# EAGLE design diptera (EAGLE 5.10)
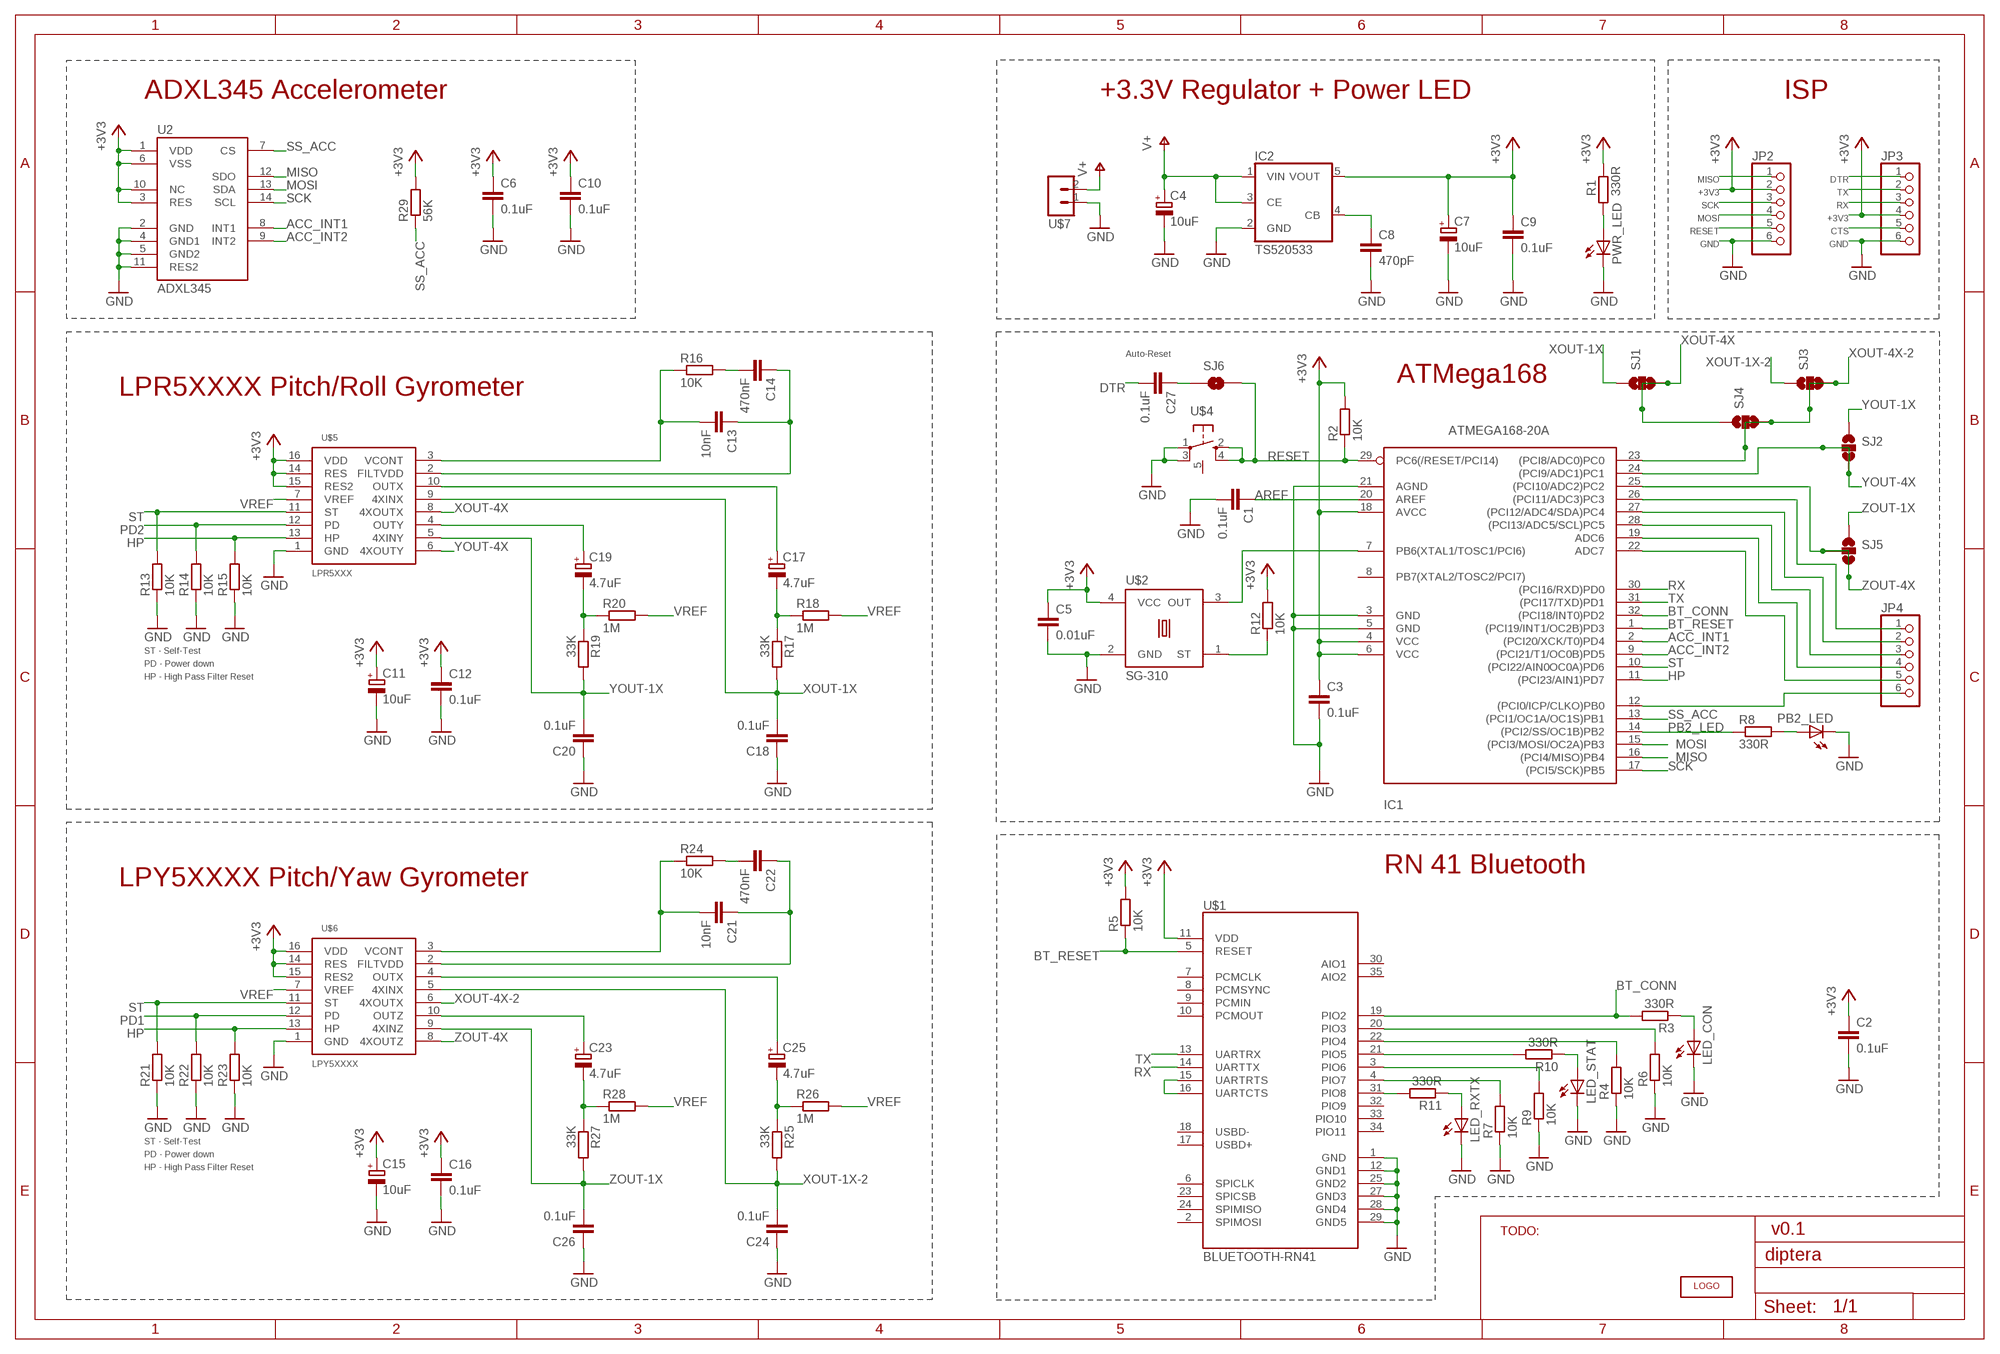
[diagram p0: schematic, sheet 1]

## Parts
C1  0.1uF  C-EUC0603K  [C0603K]
C2  0.1uF  C-EUC0603  [C0603]
C3  0.1uF  C-EUC0603K  [C0603K]
C4  10uF  CPOL-EUSMCA  [SMC_A]
C5  0.01uF  C-EUC0603K  [C0603K]
C6  0.1uF  C-EUC0603  [C0603]
C7  10uF  CPOL-EUSMCA  [SMC_A]
C8  470pF  C-EUC0603K  [C0603K]
C9  0.1uF  C-EUC0603K  [C0603K]
C10  0.1uF  C-EUC0603  [C0603]
C11  10uF  CPOL-EUSMCA  [SMC_A]
C12  0.1uF  C-EUC0603K  [C0603K]
C13  10nF  C-EUC0603K  [C0603K]
C14  470nF  C-EUC0603K  [C0603K]
C15  10uF  CPOL-EUSMCA  [SMC_A]
C16  0.1uF  C-EUC0603K  [C0603K]
C17  4.7uF  CPOL-EUSMCA  [SMC_A]
C18  0.1uF  C-EUC0603K  [C0603K]
C19  4.7uF  CPOL-EUSMCA  [SMC_A]
C20  0.1uF  C-EUC0603K  [C0603K]
C21  10nF  C-EUC0603K  [C0603K]
C22  470nF  C-EUC0603K  [C0603K]
C23  4.7uF  CPOL-EUSMCA  [SMC_A]
C24  0.1uF  C-EUC0603K  [C0603K]
C25  4.7uF  CPOL-EUSMCA  [SMC_A]
C26  0.1uF  C-EUC0603K  [C0603K]
C27  0.1uF  C-EUC0603K  [C0603K]
IC1  ATMEGA168-20A  [TQFP32-08]
IC2  TS520533  [SOT25]
JP2  PINHD-1X6  [1X06]
JP3  PINHD-1X6  [1X06]
JP4  PINHD-1X6  [1X06]
LED_CON  LEDCHIPLED_0805  [CHIPLED_0805]
LED_RXTX  LEDCHIPLED_0805  [CHIPLED_0805]
LED_STAT  LEDCHIPLED_0805  [CHIPLED_0805]
PB2_LED  LEDCHIPLED_0805  [CHIPLED_0805]
PWR_LED  LEDCHIPLED_0805  [CHIPLED_0805]
R1  330R  R-EU_R0603  [R0603]
R2  10K  R-EU_R0603  [R0603]
R3  330R  R-EU_R0603  [R0603]
R4  10K  R-EU_R0603  [R0603]
R5  10K  R-EU_R0603  [R0603]
R6  10K  R-EU_R0603  [R0603]
R7  10K  R-EU_R0603  [R0603]
R8  330R  R-EU_R0603  [R0603]
R9  10K  R-EU_R0603  [R0603]
R10  330R  R-EU_R0603  [R0603]
R11  330R  R-EU_R0603  [R0603]
R12  10K  R-EU_R0603  [R0603]
R13  10K  R-EU_R0603  [R0603]
R14  10K  R-EU_R0603  [R0603]
R15  10K  R-EU_R0603  [R0603]
R16  10K  R-EU_R0603  [R0603]
R17  33K  R-EU_R0603  [R0603]
R18  1M  R-EU_R0603  [R0603]
R19  33K  R-EU_R0603  [R0603]
R20  1M  R-EU_R0603  [R0603]
R21  10K  R-EU_R0603  [R0603]
R22  10K  R-EU_R0603  [R0603]
R23  10K  R-EU_R0603  [R0603]
R24  10K  R-EU_R0603  [R0603]
R25  33K  R-EU_R0603  [R0603]
R26  1M  R-EU_R0603  [R0603]
R27  33K  R-EU_R0603  [R0603]
R28  1M  R-EU_R0603  [R0603]
R29  56K  R-EU_R0603  [R0603]
SJ1  SOLDERJUMPER_2WAYPASTE2&3  [SJ_3_PASTE2&3]
SJ2  SOLDERJUMPER_2WAYPASTE2&3  [SJ_3_PASTE2&3]
SJ3  SOLDERJUMPER_2WAYPASTE2&3  [SJ_3_PASTE2&3]
SJ4  SOLDERJUMPER_2WAYPASTE2&3  [SJ_3_PASTE2&3]
SJ5  SOLDERJUMPER_2WAYPASTE2&3  [SJ_3_PASTE2&3]
SJ6  SOLDERJUMPERNC  [SJ_2S]
U2  ADXL345  [LGA14]
U$1  BLUETOOTH-RN41  [RN41]
U$2  SG-310  [SG-310]
U$3  LOGOSMALL  [LOGO-SMALL]
U$4  MCIPTG23K-V  [MCIPTG]
U$5  LPR5XXX  [LPR5XXX]
U$6  LPY5XXXX  [LPY5XXX]
U$7  2X1_JST_HEADER_SIDE-ENTRY  [2X1_JSP_HEADER_SIDE-ENTRY]

## Nets
+3V3: C2.1 C3.1 C5.1 C6.1 C7.+ C9.1 C10.1 C11.+ C12.1 C15.+ C16.1 IC1.4(VCC) IC1.6(VCC) IC1.18(AVCC) IC2.5(VOUT) JP2.2 JP3.4 R1.2 R2.2 R5.2 R12.2 R29.2 U2.1(VDD) U2.3(RES) U2.6(VSS) U2.10(NC) U$1.11(VDD) U$2.4(VCC) U$5.14(RES) U$5.15(RES2) U$5.16(VDD) U$6.14(RES) U$6.15(RES2) U$6.16(VDD)
ACC_INT1: IC1.2((PCI20/XCK/T0)PD4) U2.8(INT1)
ACC_INT2: IC1.9((PCI21/T1/OC0B)PD5) U2.9(INT2)
AREF: C1.1 IC1.20(AREF)
BT_CONN: IC1.32((PCI18/INT0)PD2) R3.2 U$1.19(PIO2)
BT_RESET: IC1.1((PCI19/INT1/OC2B)PD3) R5.1 U$1.5(RESET)
BT_STATUS: R10.2 U$1.21(PIO5)
CTS: JP3.5
DTR: C27.2 JP3.1
GND: C1.2 C2.2 C3.2 C4.- C5.2 C6.2 C7.- C8.2 C9.2 C10.2 C11.- C12.2 C15.- C16.2 C18.1 C20.1 C24.1 C26.1 IC1.3(GND) IC1.5(GND) IC1.21(AGND) IC2.2(GND) JP2.6 JP3.6 LED_CON.C LED_RXTX.C LED_STAT.C PB2_LED.C PWR_LED.C R4.1 R6.1 R7.1 R9.1 R13.1 R14.1 R15.1 R21.1 R22.1 R23.1 U2.2(GND) U2.4(GND1) U2.5(GND2) U2.11(RES2) U$1.1(GND) U$1.12(GND1) U$1.25(GND2) U$1.27(GND3) U$1.28(GND4) U$1.29(GND5) U$2.2(GND) U$4.1 U$4.3 U$5.1(GND) U$6.1(GND) U$7.1
HP: IC1.11((PCI23/AIN1)PD7) R15.2 R23.2 U$5.13(HP) U$6.13(HP)
MISO: IC1.16((PCI4/MISO)PB4) JP2.1 U2.12(SDO)
MOSI: IC1.15((PCI3/MOSI/OC2A)PB3) JP2.4 U2.13(SDA)
N$2: IC1.7(PB6(XTAL1/TOSC1/PCI6)) U$2.3(OUT)
N$3: PWR_LED.A R1.1
N$4: U$1.15(UARTRTS) U$1.16(UARTCTS)
N$5: LED_CON.A R3.1
N$6: R7.2 U$1.4(PIO7)
N$7: R4.2 U$1.22(PIO4)
N$8: R6.2 U$1.20(PIO3)
N$9: R9.2 U$1.3(PIO6)
N$10: LED_RXTX.A R11.1
N$11: LED_STAT.A R10.1
N$12: R11.2 U$1.31(PIO8)
N$13: C8.1 IC2.4(CB)
N$14: R12.1 U$2.1(ST)
N$15: C13.2 R16.1 U$5.3(VCONT)
N$16: C14.2 R16.2
N$17: C17.+ U$5.10(OUTX)
N$18: C17.- R17.1 R18.1
N$19: C19.+ U$5.4(OUTY)
N$20: C19.- R19.1 R20.1
N$21: C13.1 C14.1 U$5.2(FILTVDD)
N$23: IC1.26((PCI11/ADC3)PC3) JP4.1
N$24: C21.2 R24.1 U$6.3(VCONT)
N$25: C22.2 R24.2
N$26: C25.+ U$6.4(OUTX)
N$27: C25.- R25.1 R26.1
N$28: C23.+ U$6.10(OUTZ)
N$29: C23.- R27.1 R28.1
N$30: C21.1 C22.1 U$6.2(FILTVDD)
N$34: PB2_LED.A R8.2
N$35: IC1.27((PCI12/ADC4/SDA)PC4) JP4.2
N$36: IC1.28((PCI13/ADC5/SCL)PC5) JP4.3
N$37: IC1.19(ADC6) JP4.4
N$38: IC1.22(ADC7) JP4.5
N$39: IC1.12((PCI0/ICP/CLKO)PB0) JP4.6
N$40: C27.1 SJ6.1
PB2_LED: IC1.14((PCI2/SS/OC1B)PB2) R8.1
PD1: R22.2 U$6.12(PD)
PD2: R14.2 U$5.12(PD)
RESET: IC1.29(PC6(/RESET/PCI14)) JP2.5 R2.1 SJ6.2 U$4.2 U$4.4
RX: IC1.30((PCI16/RXD)PD0) JP3.3 U$1.14(UARTTX)
SCK: IC1.17((PCI5/SCK)PB5) JP2.3 U2.14(SCL)
SS_ACC: IC1.13((PCI1/OC1A/OC1S)PB1) R29.1 U2.7(CS)
ST: IC1.10((PCI22/AIN0OC0A)PD6) R13.2 R21.2 U$5.11(ST) U$6.11(ST)
TX: IC1.31((PCI17/TXD)PD1) JP3.2 U$1.13(UARTRX)
V+: C4.+ IC2.1(VIN) IC2.3(CE) U$7.2
VREF: R18.2 R20.2 R26.2 R28.2 U$5.7(VREF) U$6.7(VREF)
XOUT-1X: C18.2 R17.2 SJ1.1 U$5.9(4XINX)
XOUT-1X-2: C24.2 R25.2 SJ3.1 U$6.5(4XINX)
XOUT-4X: SJ1.2 SJ1.3 SJ4.1 U$5.8(4XOUTX)
XOUT-4X-2: IC1.23((PCI8/ADC0)PC0) SJ3.2 SJ3.3 SJ4.2 SJ4.3 U$6.6(4XOUTX)
YOUT-1X: C20.2 R19.2 SJ2.1 U$5.5(4XINY)
YOUT-4X: IC1.24((PCI9/ADC1)PC1) SJ2.2 SJ2.3 U$5.6(4XOUTY)
ZOUT-1X: C26.2 R27.2 SJ5.1 U$6.9(4XINZ)
ZOUT-4X: IC1.25((PCI10/ADC2)PC2) SJ5.2 SJ5.3 U$6.8(4XOUTZ)
Unconnected: IC1.8(PB7(XTAL2/TOSC2/PCI7)) U$1.2(SPIMOSI) U$1.6(SPICLK) U$1.7(PCMCLK) U$1.8(PCMSYNC) U$1.9(PCMIN) U$1.10(PCMOUT) U$1.17(USBD+) U$1.18(USBD-) U$1.23(SPICSB) U$1.24(SPIMISO) U$1.30(AIO1) U$1.32(PIO9) U$1.33(PIO10) U$1.34(PIO11) U$1.35(AIO2) U$4.5

## Notes on the sheet
- ADXL345 Accelerometer | +3.3V Regulator + Power LED | ISP
- Auto-Reset
- ATMega168
- LPR5XXXX Pitch/Roll Gyrometer
- ST - Self-Test
- PD - Power down
- HP - High Pass Filter Reset
- RN 41 Bluetooth
- LPY5XXXX Pitch/Yaw Gyrometer
- ST - Self-Test
- PD - Power down
- HP - High Pass Filter Reset
- TODO: | v0.1

## Library data of the parts
C1-C3 C5 C6 C8-C10 C12-C14 C16 C18 C20-C22 C24 C26 C27 = rcl:C-EU: CAPACITOR, European symbol
C4 C7 C11 C15 C17 C19 C23 C25 = rcl:CPOL-EU: POLARIZED CAPACITOR, European symbol
IC1 = avr:ATMEGA168: MICROCONTROLLER 16 kBytes FLASH 1 kBytes SRAM 512 Bytes EEPROM USART 8-channel 10 bit ADC
IC2 = v-reg:TS5205: 150mA Low Noise LDO Voltage Regulator with Enable TSC [Taiwan Semiconductor Company, Ltd] Source: http://www.taiwansemi.com .. 5205_0409c.pdf
JP2-JP4 = pinhead:PINHD-1X6: PIN HEADER
LED_CON LED_RXTX LED_STAT PB2_LED PWR_LED = led:LED: LED OSRAM: - CHIPLED LG R971, LG N971, LY N971, LG Q971, LY Q971, LO R971, LY R971 LH N974, LH R974 LS Q976, LO Q976, LY Q976 LO Q996 - Hyper CHIPLED LW Q18S LB Q993, LB Q99A, LB R99A - SideLED LS A670, LO A670, LY A670, LG A670, LP A670 LB A673, LV A673, LT A673, LW A673 LH A674 LY A675 LS A676, LA A676, LO A676, LY A676, LW A676 LS A679, LY A679, LG A679 - Hyper Micro SIDELED® LS Y876, LA Y876, LO Y876, LY Y876 LT Y87S - SmartLED LW L88C, LW L88S LB L89C, LB L89S, LG L890 LS L89K, LO L89K, LY L89K LS L896, LA L896, LO L896, LY L896 - TOPLED LS T670, LO T670, LY T670, LG T670, LP T670 LSG T670, LSP T670, LSY T670, LOP T670, LYG T670 LG T671, LOG T671, LSG T671 LB T673, LV T673, LT T673, LW T673 LH T674 LS T676, LA T676, LO T676, LY T676, LB T676, LH T676, LSB T676, LW T676 LB T67C, LV T67C, LT T67C, LS T67K, LO T67K, LY T67K, LW E67C LS E67B, LA E67B, LO E67B, LY E67B, LB E67C, LV E67C, LT E67C LW T67C LS T679, LY T679, LG T679 LS T770, LO T770, LY T770, LG T770, LP T770 LB T773, LV T773, LT T773, LW T773 LH T774 LS E675, LA E675, LY E675, LS T675 LS T776, LA T776, LO T776, LY T776, LB T776 LHGB T686 LT T68C, LB T68C - Hyper Mini TOPLED® LB M676 - Mini TOPLED Santana® LG M470 LS M47K, LO M47K, LY M47K Source: http://www.osram.convergy.de LUXEON: - LUMILED® LXK2-PW12-R00, LXK2-PW12-S00, LXK2-PW14-U00, LXK2-PW14-V00 LXK2-PM12-R00, LXK2-PM12-S00, LXK2-PM14-U00 LXK2-PE12-Q00, LXK2-PE12-R00, LXK2-PE12-S00, LXK2-PE14-T00, LXK2-PE14-U00 LXK2-PB12-K00, LXK2-PB12-L00, LXK2-PB12-M00, LXK2-PB14-N00, LXK2-PB14-P00, LXK2-PB14-Q00 LXK2-PR12-L00, LXK2-PR12-M00, LXK2-PR14-Q00, LXK2-PR14-R00 LXK2-PD12-Q00, LXK2-PD12-R00, LXK2-PD12-S00 LXK2-PH12-R00, LXK2-PH12-S00 LXK2-PL12-P00, LXK2-PL12-Q00, LXK2-PL12-R00 Source: www.luxeon.com KINGBRIGHT: KA-3528ASYC Source: www.kingbright.com
R1-R29 = rcl:R-EU_: RESISTOR, European symbol
SJ1-SJ5 = SparkFun:SOLDERJUMPER_2WAY: Solder Jumper 2 way solder jumper
SJ6 = SparkFun:SOLDERJUMPER: Solder Jumper Standard SMD solder jumper. Used to automate production. Two varients : Normally Open and Normally Closed are the same, but have different paste layers. NC will have a large amount of paste and should jumper during reflow.
U2 = sensors:ADXL345: ADXL345 Digital 3-axis Accelerometer Original Footprint by SparkFun, revised & corrected.
U$1 = own:BLUETOOTH-RN41: Roving Networks RN41 Bluetooth Module Original (broken) design by SparkFun, completely revised and fixed.
U$2 = crystals:SG-310: Epson SG-310 SPXO Crystal Oscillator
U$3 = own:LOGO
U$4 = switch:MCIPTG23K-V: MULTICOMP - MCIPTG23K-V - SWITCH, 2.8X3.8MM VERTICAL PUSH Hersteller: MULTICOMP Farnell Best.Nr.: 1605470 Herst.Bez.: MCIPTG23K-V RoHS-konform : Ja Beschreibung SWITCH, 2.8X3.8MM VERTICAL PUSH Serie:Vertical Push Schaltfunktionstyp:Momentary Kontaktkonfigurationen:SPST Strom, Kontakt, AC- max.:50mA Anschlusstyp:SMD Actuator / Cap Colour:Weiß Anschlussart:SMD Auflage, Kontakt:Silver Breite/Weite:4.34mm Haltbarkeit, elektrisch:100000 IP Schutzart:IP 40 Kraft, Betriebs- max.:160gf Länge/Höhe, Außen-:1.9mm Material, Kontakt-:Stainless Steel Nennspannung, DC:12V dc Nennstrom:50mA Spannung, Isolationswiderstand:100V dc Spannungsfestigkeit, VAC:100V ac Temperatur, Betriebs- max.:80°C Temperatur, Betriebs- min.:-30°C Tiefe, Aussen:2.8mm Weg:0.25mm Widerstand, Isolations-:100Mohm Widerstand, Kontakt-:100mohm
U$5 = sensors:LPR5XXX: LPRXXXX Dual-Axis Gyro: Pitch+Roll Axis: Right-Hand Rule
U$6 = sensors:LPY5XXXX: LPYXXXX Dual-Axis Gyro: Pitch+Yaw Axis: Right-Hand Rule
U$7 = connector:2X1_JST_HEADER_SIDE-ENTRY: JST HEADER, SIDE ENTRY, 2WAY (JAPAN SOLDERLESS TERMINALS) - S2B-PH-K-S (LF)(SN) Farnell Best.Nr.: 9491902

## Board
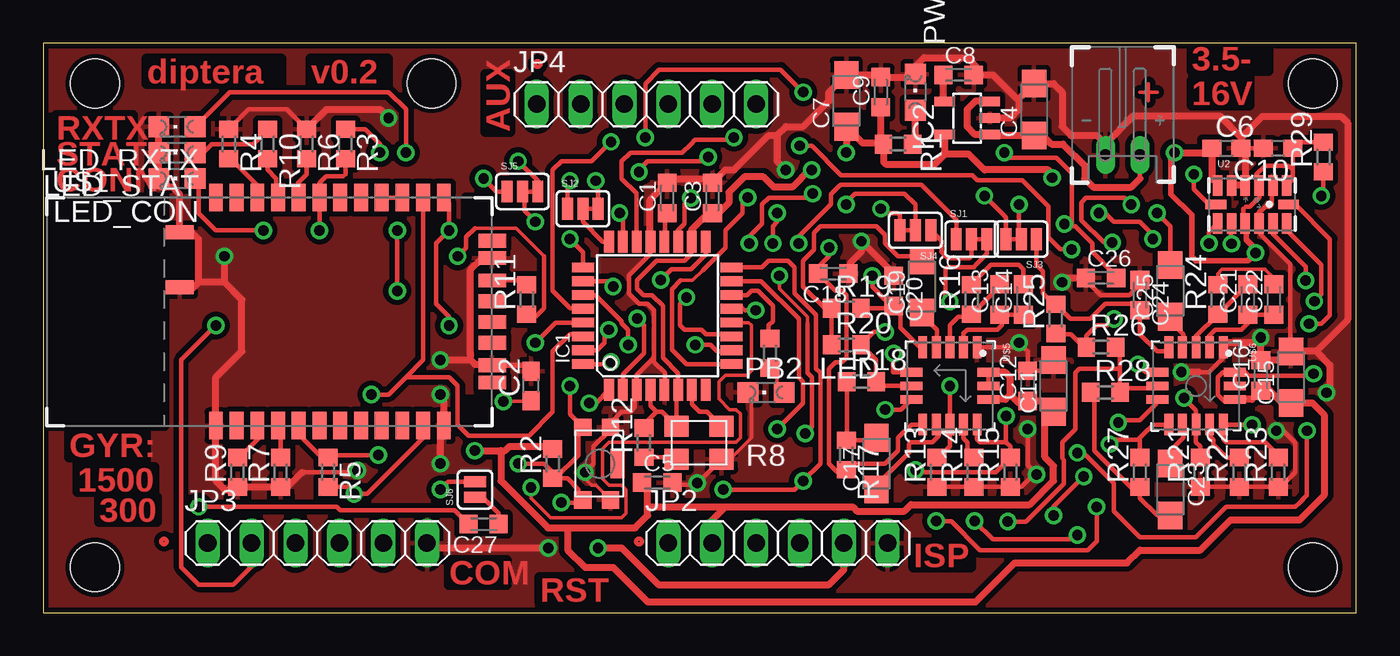
[diagram p1: board, top side]
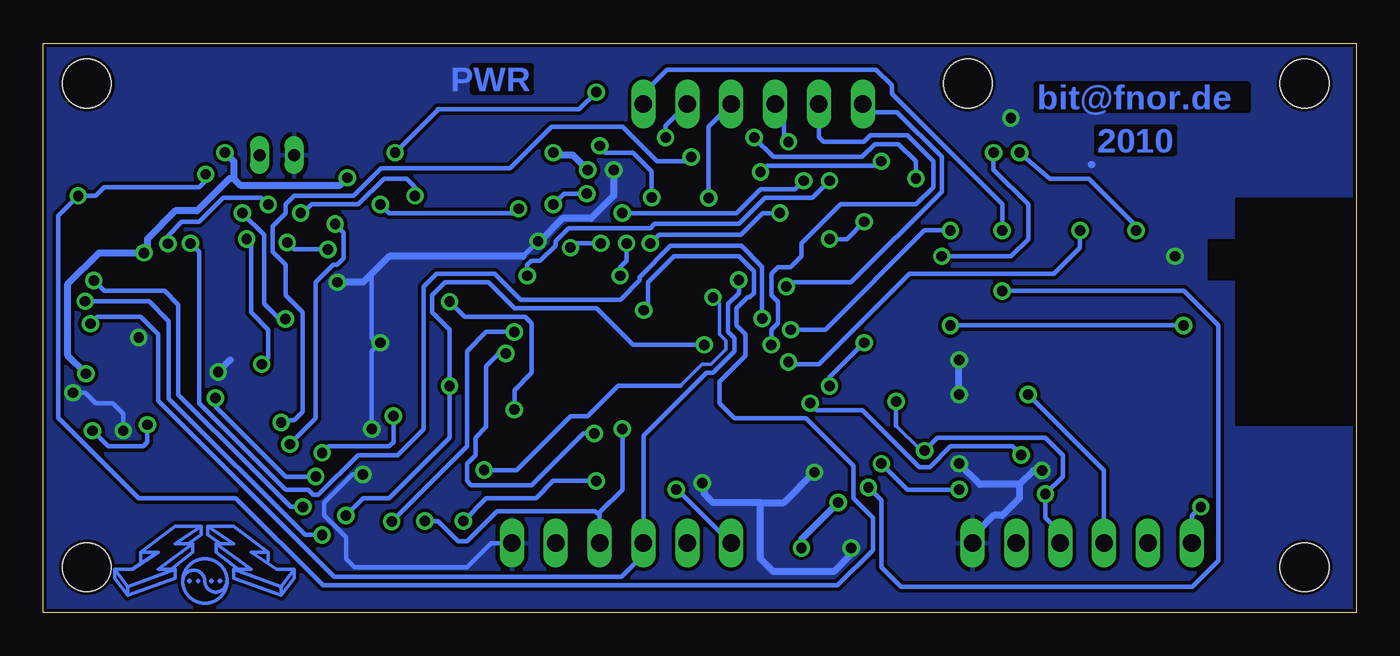
[diagram p2: board, bottom side, seen from below]

Size 76.03 x 32.96 mm. Coordinates in mm from the lower left corner, seen from the top.
Outline: 0,0 76.03,0 76.03,32.96 0,32.96 0,0
Copper layers (1*16): Top 0.035mm / dielectric 1.5mm / Bottom 0.035mm
Design rules "haka_zwilling *": minimum track width 0.2mm, minimum drill 0.5mm, track to track 0.2mm, track to pad 0.2mm, pad to pad 0.2mm, via to via 0.2mm, smd to smd 0mil, copper to edge 0.2mm, drill to drill 0.2mm, minimum pad ring 0.2mm, minimum via ring 0.2mm, stop-mask expansion 0.1mm, vias tented up to drill 0mil, thermal gap 10mil
Holes 2.8 mm at 22.5,30.62 3,2.62 73.5,2.62 3,30.62 73.5,30.62

### Footprints (pad centres in the part's own frame; a part is rotated, then mirrored left to right if it is on the bottom)
C0603K = smd 1.05 x 1.08: 1 -0.875,0; 2 0.875,0
C0603 = smd 1.1 x 1: 1 -0.85,0; 2 0.85,0
SMC_A = smd 1.6 x 1.4: + -1.5,0; - 1.5,0
TQFP32-08 = smd 1.27 x 0.559: 1 -4.293,2.8; 2 -4.293,2; 3 -4.293,1.2; 4 -4.293,0.4; 5 -4.293,-0.4; 6 -4.293,-1.2; 7 -4.293,-2; 8 -4.293,-2.8; 17 4.293,-2.8; 18 4.293,-2; 19 4.293,-1.2; 20 4.293,-0.4; 21 4.293,0.4; 22 4.293,1.2; 23 4.293,2; 24 4.293,2.8 | smd 0.559 x 1.27: 9 -2.8,-4.293; 10 -2,-4.293; 11 -1.2,-4.293; 12 -0.4,-4.293; 13 0.4,-4.293; 14 1.2,-4.293; 15 2,-4.293; 16 2.8,-4.293; 25 2.8,4.293; 26 2,4.293; 27 1.2,4.293; 28 0.4,4.293; 29 -0.4,4.293; 30 -1.2,4.293; 31 -2,4.293; 32 -2.8,4.293
SOT25 = smd 0.55 x 1.2: 1 -0.95,-1.3; 2 0,-1.3; 3 0.95,-1.3; 4 0.95,1.3; 5 -0.95,1.3
1X06 = drill 1.016 long: 1 -6.35,0; 2 -3.81,0; 3 -1.27,0; 4 1.27,0; 5 3.81,0; 6 6.35,0
CHIPLED_0805 = smd 1.2 x 1.2: A 0,-1.05; C 0,1.05
R0603 = smd 1 x 1.1: 1 -0.85,0; 2 0.85,0
SJ_3_PASTE2&3 = smd 0.635 x 1.27: 1 -0.889,0; 2 0,0; 3 0.889,0
SJ_2S = smd 0.635 x 1.27: 1 -0.45,0; 2 0.45,0
LGA14 = smd 0.55 x 1.2: 1 2,1.1; 2 1.2,1.1; 3 0.4,1.1; 4 -0.4,1.1; 5 -1.2,1.1; 6 -2,1.1; 8 -2,-1.1; 9 -1.2,-1.1; 10 -0.4,-1.1; 11 0.4,-1.1; 12 1.2,-1.1; 13 2,-1.1 | smd 1.2 x 0.55: 7 -2.1,0; 14 2.1,0
RN41 = smd 0.8 x 1.6: 1 -3.1,-6.5; 2 -1.9,-6.5; 3 -0.7,-6.5; 4 0.5,-6.5; 5 1.7,-6.5; 6 2.9,-6.5; 7 4.1,-6.5; 8 5.3,-6.5; 9 6.5,-6.5; 10 7.7,-6.5; 11 8.9,-6.5; 12 10.1,-6.5; 13 10.1,6.7; 14 8.9,6.7; 15 7.7,6.7; 16 6.5,6.7; 17 5.3,6.7; 18 4.1,6.7; 19 2.9,6.7; 20 1.7,6.7; 21 0.5,6.7; 22 -0.7,6.7; 23 -1.9,6.7; 24 -3.1,6.7 | smd 1.6 x 0.8: 25 -5.2,4.7; 27 -5.2,1.5; 28 12.9,3.2; 29 12.9,-3; 30 12.9,4.2; 31 12.9,1.9; 32 12.9,0.7; 33 12.9,-0.5; 34 12.9,-1.7; 35 12.9,-4
SG-310 = smd 1.4 x 1.2: 1 0.7,0.6; 2 3.3,0.6; 3 3.3,2.5; 4 0.7,2.5
MCIPTG = smd 1 x 1: 1 -2.1,0.6; 2 -2.1,-1; 3 2.1,0.6; 4 2.1,-1 | smd 1.7 x 0.8: 5 0,1
LPR5XXX = smd 1.27 x 0.508: 1 -2.235,1.575; 2 -2.235,0.787; 3 -2.235,0; 4 -2.235,-0.787; 5 -2.235,-1.575; 9 2.235,-1.575; 10 2.235,-0.787; 11 2.235,0; 12 2.235,0.787; 13 2.235,1.575 | smd 0.508 x 1.27: 6 -0.787,-2.235; 7 0,-2.235; 8 0.787,-2.235; 14 0.787,2.235; 15 0,2.235; 16 -0.787,2.235
LPY5XXX = smd 1.27 x 0.508: 1 -2.235,1.575; 2 -2.235,0.787; 3 -2.235,0; 4 -2.235,-0.787; 5 -2.235,-1.575; 9 2.235,-1.575; 10 2.235,-0.787; 11 2.235,0; 12 2.235,0.787; 13 2.235,1.575 | smd 0.508 x 1.27: 6 -0.787,-2.235; 7 0,-2.235; 8 0.787,-2.235; 14 0.787,2.235; 15 0,2.235; 16 -0.787,2.235
2X1_JSP_HEADER_SIDE-ENTRY = drill 0.7 long: 1 0,0; 2 2,0

### Placement (x,y rotation side)
C1  36.12,24 90 top
C2  28.25,13.12 90 top
C3  38.75,24 90 top
C4  57.37,29.12 90 top
C5  35.56,7.53 0 top
C6  68.5,26.87 0 top
C7  46.5,29.62 90 top
C8  53,31.12 0 top
C9  48.5,30.12 90 top
C10  71.5,26.87 180 top
C11  58.5,13.13 90 top
C12  57,13.13 90 top
C13  55.38,18.12 90 top
C14  56.75,18.12 90 top
C15  72.25,13.62 90 top
C16  70.5,13.72 90 top
C17  48.25,8.62 90 top
C18  45.75,19.63 180 top
C19  50.88,18.88 90 top
C20  49.25,18.63 270 top
C21  69.75,18.12 90 top
C22  71.25,18.12 90 top
C23  65.25,7.12 270 top
C24  63.5,18.38 270 top
C25  65.25,18.62 90 top
C26  61.25,19.38 0 top
C27  25.5,5.12 180 top
IC1  35.56,17.19 90 top
IC2  53.5,28.62 90 top
JP2  42.55,4.03 0 top
JP3  15.88,4.03 0 top
JP4  34.92,29.43 0 top
LED_CON  7.75,25.12 90 top
LED_RXTX  7.75,28.12 90 top
LED_STAT  7.75,26.62 90 top
PB2_LED  41.86,12.75 90 top
PWR_LED  50.5,30.12 0 top
R1  49.5,27.12 180 top
R2  29.5,8.62 90 top
R3  17.5,27.12 270 top
R4  10.75,27.12 270 top
R5  16.5,8.12 270 top
R6  15.25,27.12 270 top
R7  13.75,8.12 90 top
R8  42.08,15.01 270 top
R9  11.25,8.12 90 top
R10  13,27.12 270 top
R11  28,18.13 90 top
R12  34.78,9.84 90 top
R13  51.75,8.12 90 top
R14  53.88,8.12 90 top
R15  56,8.12 90 top
R16  53.75,18.12 90 top
R17  46.5,9.12 270 top
R18  47.37,13.37 0 top
R19  46.5,17.62 0 top
R20  46.5,15.5 0 top
R21  67,8.12 90 top
R22  69.25,8.12 90 top
R23  71.5,8.12 90 top
R24  68,18.12 90 top
R25  58.62,17 90 top
R26  61.25,15.38 0 top
R27  63.5,8.13 90 top
R28  61.5,12.75 0 top
R29  74.12,26.37 90 top
SJ1  53.75,21.62 0 top
SJ2  31.25,23.37 0 top
SJ3  56.62,21.62 180 top
SJ4  50.5,22.12 180 top
SJ5  27.75,24.38 0 top
SJ6  25,7.12 90 top
U2  70,23.62 0 top
U$1  13.1,17.32 0 top
U$2  35.97,8.28 0 top
U$3  66.67,1.82 0 bottom
U$4  32.25,8.63 270 top
U$5  52.5,13.12 270 top
U$6  66.75,13.12 270 top
U$7  61.5,26.48 0 top

### Tracks (layer width: path | path; a pad name or v marks a point on that pad's centre or on a via)
+3V3  (via drill 0.6)
  Top 0.203: IC1.18 37.5,21.42 | v26.65,12.22 28.2,12.22 C2.1
  Top 0.254: U$6.14 69.5,12.34 69.41,12.25 68.38,12.25 68,12.62 | U$6.16 69.21,13.91 | 56.5,12.12 56.88,12.12 C12.1 | C11.+ 57.88,12.25 | U$5.16 U$5.15 | R5.2 17.6,7.28 v18,6.88 18.75,6.88 22,10.12 U$1.11 | IC1.4 35.16,11.96 35.5,11.62 | 35.5,11.62 35.83,11.62 U$2.4 36.67,12.81 IC1.6 36.76,13.86 35.88,14.75 35.88,17.75 35.25,18.38 34.75,18.38 34.38,18.75 34.38,19.25 35.5,20.38 37.12,20.38 37.5,20.75 37.5,21.42 | R12.2 34.77,10.9 35.5,11.62 | 37.5,21.42 37.5,21 | IC1.18 37.5,21.42 | 58,11.12 C11.+ | C11.+ | 67.65,25.07 U2.6 | 72.35,25.62 72.35,25.07 U2.1 72,25.12 | 72.35,25.62 C10.1 72.7,27.23 R29.2 | 70.12,23.75 69.88,23.5 69.62,23.5 69.5,23.38 69.5,22.62 U2.10 | 39,23.12 C3.1 | C3.1 38.62,23.25 | C3.1 38.5,22.88 | 72.35,25.62 72.1,25.88 70.75,25.88 70.25,25.38 70.25,24.88 U2.3 70.4,24.02 70.12,23.75 | 70.12,23.75 | 58,11.12 | 67.65,26.62 C6.1 | 68.29,13.91 U$6.16 | 68,12.62 | U$6.16 U$6.15 | 71.03,12.85 C16.1 | v73.55,13.82 73.45,13.72 69.8,13.72 69.61,13.91 U$6.16 | 68.29,13.91 | 68.29,13.91 68,13.62 68,12.62 | 38,22.62
  Top 0.305: 69.65,22.48 69.65,21.57 70.2,21.02 | v70.2,20.82 69.75,20.38 66.75,20.38 66.5,20.62 66.5,23.02 65.3,24.23 65.3,26.43 v65.5,26.62
  Top 0.406: U$5.16 55.71,13.91 56,13.62 56,12.62 | 56.5,12.12 56,12.62 | 57.88,12.25 C12.1 | U$5.14 55.71,12.34 56,12.62 | v25,9.38 26.5,9.38 | 26.5,9.38 26.75,9.38 27,9.62 29.35,9.62 R2.2 | 30.38,4.9 29.23,4.9 26.5,7.62 26.5,9.38 | 30.38,4.9 34.27,4.9 35,5.62 35,6.12 | IC1.18 37.56,22.19 38,22.62 38.25,22.88 38.5,22.88 | 58,11.12 58,9 58.5,8.5 58.5,7.62 57.12,6.25 50.25,6.25 49.88,5.88 47.12,5.88 46.88,6.12 39.5,6.12 | C6.1 67.65,25.07 | 35,6.12 35,7.21 C5.1 | 72.5,12.12 73.5,12.12 74.2,11.43 74.2,6.83 72.75,5.38 68.75,5.38 67,3.62 63.5,3.62 62.75,2.88 56.25,2.88 54,0.62 35,0.62 33,2.62 31.38,2.62 30.38,3.62 30.38,4.9 | 69.5,12.34 69.99,12.34 C16.1 | 48.5,27.18 C9.1 | 48.5,27.18 R1.2 48.67,26.07 48.83,25.93 51.6,25.93 52.2,26.52 | 52.2,26.52 IC2.5 | IC2.5 | 48.5,27.18 47.45,27.18 C7.+ v46.5,26.62 | v44.5,25.62 44.38,25.62 43.38,24.62 42.3,24.62 41.7,25.23 40.6,25.23 39.7,24.32 39.7,23.73 39.1,23.12 39,23.12 | 69.65,22.48 U2.10 | 71.03,12.85 71.75,12.12 C15.+ 72.5,12.12 | 72.5,12.12 | v70.2,20.82 70.2,21.02 | 52.2,26.52 53.6,26.52 54.5,25.62 58.2,25.62 58.42,25.4 v58.42,25.18 | v65.5,26.62 67.65,26.62 | 35,6.12 39.5,6.12 | JP2.2 38.73,5.36 39.5,6.12
  Bottom 0.203: 25.25,9.38 25.25,9.43 26.65,10.82
  Bottom 0.254: 25.25,9.38 v25,9.38 24.25,10.12 18,10.12 17,9.12 17,7.88 v18,6.88 18,5.48 17.14,4.62 JP3.4 | 26.65,10.82 v26.65,12.22
  Bottom 0.406: v44.5,25.62 45.38,26.5 46.38,26.5 v46.5,26.62 | v70.2,20.82 72.8,20.82 74.6,19.02 74.6,14.88 v73.55,13.82 | 65,25.12 64.62,24.75 58.85,24.75 v58.42,25.18 | 65,25.12 65,26.12 v65.5,26.62 | 65,25.12 65.25,25.12 67.12,23.25 68.38,23.25 70,21.62 70,21.12 70.25,20.88
ACC_INT1  (via drill 0.6)
  Top 0.254: IC1.2 33.56,13.79 34.8,15.03 34.8,16.62 v34.4,17.02 | v67.5,21.38 67.5,22.02 U2.8
  Bottom 0.254: v34.4,17.02 34.4,20.02 35.6,21.23 39.7,21.23 41.5,19.43 41.5,19.23 42.6,18.12 48.4,18.12 49.9,19.62 53.25,19.62 54,18.88 54,10.62 55.5,9.12 57.8,9.12 60.1,6.83 60.4,6.83 60.7,7.12 62,7.12 67,12.12 67,20.88 v67.5,21.38
ACC_INT2  (via drill 0.6)
  Top 0.203: 36.9,19.23 37.6,19.23 38.2,19.82
  Top 0.254: U2.9 68.75,22.48 68.75,21.4 v68.8,21.35 | v63,23.62 62.62,24 60.38,24 60.1,23.73 60.1,22.73 61.4,21.43 v61.9,21.43 | v63,23.62 | IC1.9 37.24,14.39 36.4,15.22 36.4,18.73 36.9,19.23 | 38.2,19.82 39.5,21.12 39.5,22.12 40.5,23.12 40.5,23.73 v40.8,24.02 | v43.8,27.02 44.5,27.02 46.2,25.32 53.8,25.32 54.1,25.02 56.7,25.02 58.2,23.52 58.2,21.73 58.9,21.02 v59.55,21.02
  Bottom 0.254: v68.8,21.35 68.8,21.82 68,22.62 67,22.62 65.6,24.02 63.4,24.02 v63,23.62 | v40.8,24.02 40.8,25.55 41.88,26.62 43.5,26.62 43.5,26.73 v43.8,27.02 | v59.55,21.02 61.5,21.02 v61.9,21.43
AREF
  Top 0.254: IC1.20 36,21.52 36,23 C1.1
BT_CONN  (via drill 0.6)
  Top 0.254: R3.2 17.5,25.38 17.38,25.25 16.38,25.25 16,24.88 U$1.19 v16,22.12 | 31.26,14.38 IC1.32 32.76,14.39 v32.88,14.5
  Bottom 0.254: v32.88,14.5 32.75,14.38 31.12,14.38 25.88,19.62 17.5,19.62 16,21.12 v16,22.12
BT_RESET  (via drill 0.6)
  Top 0.254: 16,9.12 R5.1 | 16,9.12 15,10.12 15,10.62 U$1.5 | 16,9.12 v19.4,9.12 | IC1.1 32,12.13 31.63,12.13 v31.62,12.12
  Bottom 0.254: v19.4,9.12 19.9,9.62 23.5,9.62 24.7,8.43 25.3,8.43 28.6,11.72 31.23,11.72 v31.62,12.12
BT_STATUS
  Top 0.254: R10.2 13,25.62 13.5,25.12 13.5,24.12 U$1.21
DTR  (via drill 0.6)
  Top 0.254: v9,6.12 17,6.12 17.2,5.92 23.82,5.92 C27.2
  Bottom 0.254: JP3.1 9.53,5.6 v9,6.12
GND  (via drill 0.6)
  Top 0.203: PB2_LED.C 41,12.56 41,10.12 39.88,9.01 39.76,9.01 39.63,8.88 U$2.2 | v31.38,8.12 31.38,7.75 31.75,7.38 32,7.38 U$4.3
  Top 0.254: R21.1 R22.1 R23.1 71.65,7.28 72.5,8.12 72.5,9.82 71.8,10.53 v71.4,10.53 | 68.59,15.62 U$6.1 68.3,15.34 68.3,14.72 67.5,13.93 66.89,13.93 | R13.1 R14.1 R15.1 56.65,7.28 57.38,8 v57.52,8 57,8.53 v57,10.62 | 57,15.12 | C12.2 57.88,14 C11.- | 8.6,22.02 U$1.25 | 8.5,18.62 8.1,18.62 U$1.27 | 11.1,7.12 R9.1 | U$1.12 23.5,10.53 | 15,8.12 18.1,8.12 | 6.7,24.68 LED_CON.C | 25.95,14.38 U$1.29 | 25.4,20.52 U$1.28 | U$1.12 23.4,10.62 | 46.75,19.5 C18.1 | C6.2 C10.2 | 71,23.5 70.75,23.5 70.25,23 70.25,22.62 70.35,22.52 U2.11 70.5,22.43 70.5,21.88 72.2,20.18 72.2,15.43 72.25,15.38 | 71,23.5 | 71,23.5 71.12,23.62 71.12,24.65 U2.2 | 35.38,14.75 35.38,17.5 35,17.88 34.5,17.88 33.91,18.46 33.91,19.54 35.12,20.75 35.12,21.44 IC1.21 | 35.38,14.75 35.38,14.5 36,13.88 36,12.93 IC1.5 | 35.38,14.75 34.36,13.74 IC1.3 34.25,12.78 34.25,11.88 34,11.62 33.5,11.62 32.85,10.97 U$4.1 32.85,10.6 31.88,9.62 31.88,8.62 v31.38,8.12 | U$5.1 56.23,15.36 v56.5,15.62 56.88,15.25 57,15.12 | 57,15.12 C12.2 | C12.2 | C5.2 36.43,7.56 36.5,7.62 36.72,7.41 37.84,7.41 37.84,7.47 v37.88,7.5 37.89,7.5 U$2.2 39.02,8.62 39,8.62 | C6.2 69.6,26.62 | 69.38,26.75 69.38,26.85 C6.2 | 23,10.62 U$1.12 | 74.5,12.93 v74.3,12.72 | 61.5,27.12 U$7.1 | 71.72,14.6 C15.- 73,15.12 | 73,15.12 | C26.1 60.38,19.25 61.25,18.38 62.88,18.38 63.25,18.75 63.5,19 C24.1 | R4.1 11.9,29.12 14.1,29.12 R6.1
  Top 0.305: U$1.29 27.9,14.32 C2.2
  Top 0.406: LED_RXTX.C LED_STAT.C LED_CON.C | 8.6,22.02 9,21.62 9,19.12 | 9,19.12 8.5,18.62 | 11.1,7.12 10.5,7.12 10,7.62 U$1.1 10,13.62 11.5,15.12 11.5,18.12 10.5,19.12 | R9.1 R7.1 14.15,7.28 15,8.12 | 18.1,8.12 v18.2,8.22 | U$1.12 23.2,12.43 v23,12.62 | v23,14.62 24.75,14.62 | 25.95,14.38 25,14.38 24.75,14.62 | 25.4,20.52 24.75,19.88 24.75,14.62 | 46.75,19.5 46.75,20.25 47.38,20.88 v47.38,21.5 | U2.5 U2.4 69.6,26.62 | v59,19.12 59.25,19.38 C26.1 60.38,19.5 | 69.38,27.5 68.12,28.75 63.12,28.75 61.5,27.12 61,27.62 59.5,27.62 59,28.12 59,30.12 58.5,30.62 C4.- 56.5,29.75 | 69.38,27.5 69.38,26.85 | IC1.21 35.15,23.9 C1.2 36.38,25.12 38.5,25.12 C3.2 39.5,25.62 40,25.62 42,27.62 42.5,27.62 | v23,8.62 23,10.62 | 74.5,12.93 74.5,14.32 73.7,15.12 | 73.7,15.12 73,15.12 72.5,15.12 | 68.59,15.62 70.2,15.62 v70.5,15.93 C16.2 71.72,14.6 | IC2.2 56,28.62 56.5,29.12 56.5,29.75 | 56.5,29.75 56.38,29.75 55,31.12 C8.2 54,31.25 54,31.62 53.5,32.12 51,32.12 50.5,31.62 PWR_LED.C 50.33,31 C9.2 48.38,31.12 C7.- 45.5,30.12 45.5,29.62 44,28.12 43,28.12 42.5,27.62 | 66.89,13.93 v65.9,13.93 | v43,25.62 42.5,26.12 42.5,27.62 | C15.- 72.25,15.38 | 69.38,27.5 | 69.38,27.5 70.6,28.73 75.15,28.73 75.53,28.35 75.53,16.95 73.7,15.12 | C20.1 49.25,19.62 v47.38,21.5 | v47.38,21.5 | 10.5,19.12 9,19.12 | 10.5,19.12 v10.5,20.62 | 6.7,24.68 6.75,24.62 7.5,24.62 7.9,24.23 U$1.25 | JP3.6 22.5,3.75 v29.25,3.75 | v20,28.62 19.5,29.12 16.4,29.12 R6.1
  Bottom 0.254: v47.38,21.5 48.25,20.62 | v57,10.62 | v57.52,8 58.12,8 59.75,6.38 59.75,5.62 58.5,4.38 58.5,3.12 58,2.62 51.5,2.62 50.09,4.03 JP2.6 | v57,10.62 57,15.12 v56.5,15.62 56.75,15.62 57,15.88 57,19.62 | 57,19.62 | 37.75,7.38 v37.88,7.5 | v71.4,10.53 71.4,11.53 72,12.12 73,12.12 73.6,12.72 v74.3,12.72 | 37.5,6.62
  Bottom 0.406: v23,12.62 v23,14.62 | 34.5,6.38 33.15,6.38 31.4,8.12 v31.38,8.12 | 34.5,6.38 37.25,6.38 37.5,6.62 37.75,6.88 37.75,7.38 | 48.25,20.62 56,20.62 57,19.62 57.5,19.12 v59,19.12 | v43,25.62 43,24.12 44.3,22.82 45.95,22.82 47.27,21.5 v47.38,21.5 | v18.2,8.22 18.7,8.22 19.5,7.42 | 19.5,7.42 19.5,6.62 20.5,5.62 21,5.62 22,4.62 22,4.25 JP3.6 | 19.5,7.42 21.8,7.42 v23,8.62 | v65.9,13.93 65.2,14.62 | 15.35,25.93 15.3,25.93 | v20,28.62 19.8,28.43 | v29.25,3.75 29.25,3.38 30.25,2.38 33.75,2.38 34.5,3.12 34.5,6.38
  pour Top (isolate 0.305): -0.1,36.03 0,0.12 76,0.12 75.9,36.03
  pour Bottom: -0.5,-1.38 -0.5,37.62 77.5,37.62 77.5,-0.88
HP  (via drill 0.6)
  Top 0.203: R15.2 56,8.75
  Top 0.254: 68.33,10.89 U$6.13 | 68.33,10.89 68.33,10.04 68.5,9.88 70.75,9.88 | 70.75,9.88 | 68.33,10.89 69.98,10.89 v70,10.88 | R23.2 71.5,9.12 70.75,9.88 | U$5.13 54.08,10.05 54.25,9.88 55.75,9.88 | 55.75,9.88 56,9.62 R15.2 | R15.2 | v37.25,18.25 36.88,17.88 36.88,16.62 37.12,16.38 38.12,16.38 38.38,16.12 38.75,16.12 | 39,16.12 39.71,16.12 IC1.11 | 55.75,9.88 v55.75,11.38 | v59.88,9.25 60.25,9.25 60.38,9.12 62,7.5 62,7.12 | 62,7.12 62,5.88 63.5,4.38 66.75,4.38 68.5,6.12 72.5,6.12 72.75,6.38 | 72.75,6.38 73,6.62 | 73,6.62 | 38.75,16.12 | 38.75,16.12 39,16.12 | 39,16.12 | 62,7.12 | v73.17,10.53 73.17,6.8 72.75,6.38 | v50.5,8.25 50.88,8.25 51,8.12 55.15,8.12 R15.2
  Bottom 0.203: 37.62,14.38 37.88,14.38 39.12,13.12 | 36.88,17.88 v37.25,18.25 36.88,17.88 | 36.88,17.88 36.88,16.12 36.5,15.75 36.5,15.25 37.38,14.38 37.62,14.38 | 37.62,14.38
  Bottom 0.254: v55.75,11.38 55.75,9.88 56,9.62 59.5,9.62 v59.88,9.25 | 39.12,13.12 42.75,13.12 44.5,11.38 45.5,11.38 48.62,8.25 v50.5,8.25 | v70,10.88 70,9.88 70.25,9.62 72.28,9.62 v73.17,10.53 | v70,10.88
MISO  (via drill 0.6)
  Top 0.254: U2.12 71.2,21.93 71.5,21.62 | 71.5,21.62 | v51.7,5.3 52.58,5.3 54.25,3.62 54.5,3.62 | 59.5,3.62 | 54.5,3.62 | v73.1,19.23 73.1,20.02 71.5,21.62 | 54.5,3.62 60.5,3.62 | 60.5,3.62 61,4.12 v61,6.12 | 60.5,3.62 59.5,3.62 | 60.5,3.62 | IC1.16 41.61,19.99 42,20.38 43.12,20.38 43.5,20 43.5,18.5 44.75,17.25 44.75,14.12 45,13.88 45,8.62 v44,7.62 43.5,7.12 v39.38,7.12
  Bottom 0.254: v61,6.12 61.7,6.12 63.95,8.38 | 63.95,8.38 | 63.95,8.38 68.2,12.62 68.2,17.82 69,18.62 72.5,18.62 v73.1,19.23 | v39.38,7.12 39.29,7.12 JP2.1 | v44,7.62 46.5,7.62 47.5,6.62 50.38,6.62 v51.7,5.3
MOSI  (via drill 0.6)
  Top 0.254: U2.13 72,22.12 74,20.12 74,18.43 v73.6,18.02 | v53.92,5.3 54.98,4.25 59.62,4.25 v59.88,4.5 | v59.88,4.5 | IC1.15 41.56,19.19 43.75,17 43.75,13.62 44,13.38 44,12.12 v42.5,10.62
  Bottom 0.254: v59.88,4.5 60.88,4.5 68.75,12.38 68.75,16.88 69.9,18.02 v73.6,18.02 | JP2.4 43.81,5.62 | 43.81,5.62 43.81,5.81 42.5,7.12 v42.5,10.62 | v53.92,5.3 53.17,5.3 52,4.12 51.5,4.12 49.75,5.88 44.06,5.88 43.81,5.62
N$2
  Top 0.254: IC1.7 37.56,12.06 38,11.62 38.43,11.62 U$2.3
N$3
  Top 0.406: PWR_LED.A 50.5,27.3 R1.1
N$4
  Top 0.254: U$1.16 U$1.15
N$5  (via drill 0.6)
  Top 0.203: LED_CON.A 8.78,25.1
  Top 0.254: v12.75,22.12 10,22.12 9,23.12 9,24.93 LED_CON.A | R3.1 18.65,27.98 19.5,27.12 v19.5,26.62
  Bottom 0.254: v12.75,22.12 12.75,22.38 15.5,25.12 17.75,25.12 v19.5,26.62
N$6
  Top 0.254: R7.2 13.75,10.68 U$1.4
N$7
  Top 0.254: R4.2 10.85,26.27 12.5,24.62 12.5,24.12 U$1.22
N$8
  Top 0.254: R6.2 15.25,25.38 14.75,24.88 14.75,24.07 U$1.20
N$9
  Top 0.254: R9.2 11.35,8.97 12.5,10.12 12.5,10.72 U$1.3
N$10  (via drill 0.6)
  Top 0.203: 29,20.62 27.38,22.25 25,22.25
  Top 0.254: 8.75,28.12 LED_RXTX.A 10.8,30.12 20,30.12 21,29.12 v21,26.62 | 8.75,28.12 | 29,20.62 29,17.62 28.5,17.12 28.15,17.12 R11.1 | v24,20.62 24.5,21.12 24.5,21.75 25,22.25
  Bottom 0.254: v24,20.62 20,20.62 19,21.62 19,23.62 21,25.62 v21,26.62
N$11
  Top 0.254: LED_STAT.A 9.25,26.62 9.75,27.12 12.15,27.12 R10.1
N$12
  Top 0.254: U$1.31 27.75,19.23 R11.2
N$13
  Top 0.406: C8.1 52.12,29.65 IC2.4
N$14
  Top 0.254: R12.1 36.56,8.99 U$2.1
N$15
  Top 0.254: U$5.3 52.5,16.62 53,17.12 53.6,17.12 R16.1 53.77,17.27 55,18.5 55,18.62 C13.2
N$16
  Top 0.254: C14.2 56.75,19.88 56.5,20.12 55,20.12 | R16.2 54.15,19.38 54.12,19.38 54.88,20.12 55,20.12 | 55,20.12
N$17
  Top 0.203: 48.5,7.5 48.5,7.38 C17.+
  Top 0.254: U$5.10 51.84,10.77 51.84,10.21 51.5,9.88 50.25,9.88 50.12,9.75 50.12,9.25 48.5,7.62 48.5,7.5
N$18
  Top 0.254: 48.4,9.97 R17.1 46.52,10 R18.1 | 48.4,9.97 48.6,9.97 | C17.- 48.4,9.97
N$19
  Top 0.254: C19.+ 50.88,17.25 51.75,16.38 51.75,15.4 U$5.4
N$20
  Top 0.254: C19.- 50.62,20.62 49.5,20.62 48.75,21.38 48.75,21.88 48.25,22.38 45,22.38 44.62,22 44.62,21 44,20.38 44,18.88 45.25,17.62 R19.1 | R19.1 | R19.1 R20.1
N$21
  Top 0.254: C14.1 C13.1 55.5,17.12 55.5,16.62 55.25,16.38 53.5,16.38 53.29,16.16 U$5.2
N$23  (via drill 0.6)
  Top 0.254: IC1.26 32.69,19.19 v33,18.88
  Bottom 0.254: v33,18.88 32.75,19.12 29.25,19.12 24,24.38 24,26.38 26.6,28.98 28.12,28.98 JP4.1
N$24
  Top 0.254: C21.2 68.03,17.27 R24.1 68,17.25 66.75,16 U$6.3 | U$6.3
N$25
  Top 0.203: R24.2 68,19.62 68.25,19.88 70.75,19.88 70.8,19.82 | 70.8,19.82 71.25,19.38 | 70.8,19.82
  Top 0.254: 71.25,19.38 C22.2
N$26
  Top 0.254: C25.+ 65.25,16.88 66,16.12 66,15.4 U$6.4
N$27  (via drill 0.6)
  Top 0.254: R25.1 58.65,16.12 59.5,16.12 60.25,15.38 R26.1 60.4,16.02 61,16.62 61.62,16.62 v62,17 | 64.75,22.88 v64.5,23.12 65.25,22.38 C25.-
  Bottom 0.254: v62,17 62.38,17 63.25,17.88 63.25,21.88 v64.5,23.12
N$28
  Top 0.254: U$6.10 66,10.85 66,10.12 65.25,9.38 C23.+
N$29
  Top 0.254: 60.88,9.38 63.12,7.12 63.35,7.12 R27.1 63.5,6.62 64.5,5.62 C23.- | 60.88,9.38 | 60.4,12.62 | 60.4,12.62 60.5,12.62 | 60.88,9.38 60.88,12.53 R28.1 60.52,12.62 60.4,12.62
N$30
  Top 0.254: C21.1 C22.1 | C21.1 | C21.1 69.75,16.75 69.38,16.38 67.88,16.38 67.5,16 67.5,15.4 U$6.2
N$34
  Top 0.203: 42.5,14.12 42.5,13.16 PB2_LED.A
  Top 0.254: 42.5,14.12 42.12,14.12 R8.2
N$35  (via drill 0.6)
  Top 0.254: IC1.27 31.99,18.39 33.5,16.88 33.5,16.75 33.88,16.38 v33.88,15.5
  Bottom 0.254: v33.88,15.5 33.88,16.38 33.5,16.75 33.5,18 33.88,18.38 33.88,19.62 33.5,20 32.75,20 32.12,20.62 32.12,21.38 29.88,23.62 25.5,23.62 24.5,24.62 24.5,26.12 26,27.62 28.12,27.62 28.5,27.25 30.84,27.25 31.11,27.52 JP4.2
N$36  (via drill 0.6)
  Top 0.254: v32.88,27.25 31.75,26.12 30,26.12 29.5,25.62 29.5,18.62 30.5,17.62 31.23,17.62 IC1.28
  Bottom 0.254: v32.88,27.25 33.12,27.25 33.12,28.9 JP4.3
N$37  (via drill 0.6)
  Top 0.254: IC1.19 36.76,22.14 37.12,22.5 37.12,23.62 v37.5,24
  Bottom 0.254: v37.5,24 37.5,28.12 JP4.4
N$38  (via drill 0.6)
  Top 0.254: IC1.22 34.36,24.26 | 34.36,24.26 34,24.62 | 34.36,24.26 | 34.36,24.26 33.5,25.12 33.5,26.12 34,26.62 37,26.62 37.5,27.12 | 37.5,27.12 | 37.5,27.12 37.75,27.38 39.86,27.38 v39.99,27.51
  Bottom 0.254: v39.99,27.51 39.99,28.17 JP4.5
N$39  (via drill 0.6)
  Top 0.203: IC1.12 40.84,16.79 41,16.62 41,14 40.75,13.75 39.5,13.75 39.12,13.38 39.12,12.38 39.75,11.75 40.12,11.75 40.38,11.5 40.38,10.12 40.12,9.88 32.75,9.88 32.38,9.5 32.38,7.75 32.75,7.38 33.5,7.38 33.75,7.12 33.75,5.75 33.5,5.5 29.38,5.5 28.25,6.62 v28.25,7.25
  Top 0.254: v20.5,18.62 v20.5,22.12
  Bottom 0.254: v20.5,22.12 20.5,23.62 26.9,30.02 26.9,30.52 27.8,31.43 39.91,31.43 41.27,30.07 JP4.6 | v20.5,18.62 10,18.62 8,16.62 8,2.99 9.5,1.49 26.36,1.49 27.5,2.62 27.5,6.5 v28.25,7.25
N$40
  Top 0.254: C27.1 26.38,5.75 26.36,5.75 25.49,6.62 | 25.49,6.62 25.5,6.62 | SJ6.1 25.43,6.67 25.49,6.62
N$41
  Top 0.203: 64,29.62 64,30.62
N$42
  Top 0.203: 64.5,30.12 63.5,30.12
N$43
  Bottom 0.2: 67.38,4 69.38,2.5 68.62,2.5 | 67.38,4 67.38,3.5 68.62,2.5 | 67.38,4 67.62,4 | 67.62,4 66.88,4.5 66.88,5 | 67.62,4 68.38,4 66.88,5 | 66.88,5 68.38,5 70.38,3.5 | 70.38,3.5 70.38,3 | 70.38,3.5 69.38,3.5 70.88,2.5 71.88,2.5 | 68.38,2.5 68.62,2.5 | 68.38,2.5 71.12,1.5 | 71.12,1.5 71.88,2.5 | 68.38,2.5 68.38,2 71.12,1 | 71.88,2.5 71.88,2 71.12,1 | 71.12,1 71.12,1.5
N$44
  Bottom 0.2: 66,4 64,2.5 64.75,2.5 | 66,4 66,3.5 64.75,2.5 | 66,4 65.75,4 | 65.75,4 66.5,4.5 66.5,5 | 65.75,4 65,4 66.5,5 | 66.5,5 65,5 63,3.5 | 63,3.5 63,3 | 63,3.5 64,3.5 62.5,2.5 61.5,2.5 | 65,2.5 64.75,2.5 | 62.25,1.5 65,2.5 | 62.25,1.5 61.5,2.5 | 65,2.5 65,2 62.25,1 | 61.5,2.5 61.5,2 62.25,1 | 62.25,1.5 62.25,1
PB2_LED
  Top 0.254: IC1.14 40.76,18.39 41,18.62 41.38,18.62 42.25,17.75 42.25,16.88 42,16.62 42,15.95 R8.1
PD1
  Top 0.254: U$6.12 67.54,10.21 67.75,10 67.75,9.75 68.53,8.97 R22.2
PD2
  Top 0.254: U$5.12 53.29,10.09 53.5,9.88 53.5,9.22 53.62,9.22 R14.2
RESET  (via drill 0.6)
  Top 0.254: IC1.29 29.66,16.79 v28.5,15.62 | U$4.2 31,10.97 | v30.5,13.12 30.5,11.47 U$4.2 | 29.65,7.78 R2.1 29.5,8.12 29,8.62 v27.5,8.62 | 29.65,7.78 31,9.12 31,10.47 U$4.2 | 29.65,7.78 30.35,7.78 31,7.12 31,6.78 U$4.4 31.1,6.38 v30,6.38 | SJ6.2 23.45,7.58 v23,7.12
  Top 0.406: JP2.5 46.35,2.48 45.5,1.62 35.62,1.62 33.5,3.75 v32.12,3.75
  Bottom 0.254: v30.5,13.12 30.5,13.62 v28.5,15.62 | v23,7.12 26,7.12 v27.5,8.62
  Bottom 0.406: v32.12,3.75 32.12,4.25 v30,6.38
RX  (via drill 0.6)
  Top 0.254: v19,12.62 20,12.62 21,13.62 | 21,13.62 22,14.62 U$1.14 | 21,13.62 23.5,13.62 24,13.12 24,10.88 24.62,10.25 28.12,10.25 29.5,11.62 29.5,15.12 30.5,16.12 31.13,16.12 IC1.30
  Bottom 0.254: JP3.3 14.61,8.23 v19,12.62
SCK  (via drill 0.6)
  Top 0.203: 38.38,21.46 IC1.17
  Top 0.254: 38.38,21.46 38.5,21.34 | v35.75,19.25 36.38,19.88 37.5,19.88 38.38,20.75 38.38,21.46 | 38.38,21.46 38.38,21 | IC1.17 38.38,21.46 | U2.14 | v73.3,16.73 74,16.73 74.5,17.23 74.5,21.62 72.5,23.62 U2.14 | U2.14
  Bottom 0.254: 35.75,18.5 v35.75,19.25 | 35.75,18.5 36.38,17.88 36.38,16.25 36,15.88 36,15.12 37.25,13.88 37.62,13.88 41.27,10.22 JP2.3 41.37,3.94 41.5,3.94 41.5,3.12 42.55,2.08 59.17,2.08 69.38,12.28 69.38,16.12 70.38,17.12 72.9,17.12 v73.3,16.73 | 35.75,18.5
SS_ACC  (via drill 0.6)
  Top 0.254: U2.7 67.5,23.62 66.62,24.5 v66.62,25.38 | v41.25,17.5 40.62,17.5 40.5,17.62 39.89,17.62 IC1.13 | R29.1 74.12,24.25 v74,24.12
  Bottom 0.254: v41.25,17.5 41,17.75 41,19.12 39.5,20.62 35.75,20.62 34.88,19.75 34.88,18.5 35.12,18.25 35.25,18.25 35.88,17.62 35.88,16.62 35.38,16.12 35.38,14.88 36.88,13.38 36.88,12.12 36,11.25 31.88,11.25 29.12,8.5 29.12,6.62 28,5.5 28,3.62 30.05,1.57 59.83,1.57 64.88,6.62 70.5,6.62 75.15,11.28 75.15,22.98 v74,24.12 73,24.12 72.5,24.62 67,24.62 66.62,25 v66.62,25.38
ST  (via drill 0.6)
  Top 0.254: R21.2 67,9.62 66.75,9.88 U$6.11 66.75,11.72 v66.05,12.43 | U$5.11 | v37.75,15.5 38.62,15.5 39,15.12 39.79,15.12 IC1.10 | v58.5,5.62 58.5,6.12 60,7.62 | 60,7.62 | 60,7.62 v60.25,7.88 | R13.2 51.85,8.97 52.5,9.62 52.5,10.12 | v52.5,13.12 52.5,10.12 | 52.5,10.12 U$5.11 | 52.5,10.12
  Bottom 0.254: 52.5,16.38 v52.5,13.12 52.5,10.12 56,6.62 57.5,6.62 v58.5,5.62 | 52.5,16.38 | 52.5,16.38 53.5,17.38 53.5,18.38 52.75,19.12 50.25,19.12 48.75,17.62 44,17.62 41.88,15.5 v37.75,15.5 | v60.25,7.88 62,7.88 66,11.88 66.05,11.93 v66.05,12.43
TX  (via drill 0.6)
  Top 0.254: IC1.31 32.06,15.19 32.5,15.62 32.5,16.12 v32.75,16.38 | U$1.13 23.5,23.73 v23.5,22.12 22.75,21.38 22.75,17.88 23.5,17.12 v23.5,16.62 | JP3.2 12.06,2.69 11,1.62 9,1.62 8,2.62 8,14.62 v10,16.62
  Bottom 0.254: v32.75,16.38 30.75,16.38 25,22.12 v23.5,22.12 | v10,16.62 v23.5,16.62
V+
  Top 0.254: 63.5,25.12 U$7.2 | IC2.1 54.85,27.62
  Top 0.406: 63.5,25.12 63,24.62 60.8,24.62 60.3,25.12 60.3,25.88 59.05,27.12 58.38,27.12 58,27.5 57.5,27.5 C4.+ 54.85,27.62 | IC2.1 53.95,27.68 53.5,28.12 53.5,29.12 54,29.62 54.75,29.62 IC2.3
VREF  (via drill 0.6)
  Top 0.254: U$5.7 50.14,13 | 62.1,12.53 62.25,12.38 62.35,12.47 R28.2 | v55.85,5.28 56.9,5.28 59.1,7.47 59.1,8.32 | 62.35,14.12 R28.2 | 62.35,14.12 62.35,15.12 R26.2 | 59,9.43 59,9.88 59.75,10.62 59.75,13.88 59.88,14 | 59.88,14 | 59.88,14 60,14.12 62.35,14.12 | U$6.7 64.39,13 62.6,13 R28.2 | 59.1,8.32 | 59.1,8.32 59.1,8.82 59,8.93 59,9.43 | 59,9.43 59,9.12 | 59,9.12 | 49,13.12 U$5.7 | U$5.7 | 49,13.12 | v48.75,16.25 48.1,16.25 R20.2 48.23,14.62 R18.2 48.48,13.12 49,13.12
  Bottom 0.254: 55,6.12 51.5,9.62 51.5,15.12 50.38,16.25 v48.75,16.25 | 55,6.12 | 55,6.12 v55.85,5.28
XOUT-1X  (via drill 0.6)
  Top 0.203: 46.5,15.62 46.5,15.75
  Top 0.254: C18.2 45,19.5 | v43.75,21.38 43.75,21.77 44.7,22.73 45.3,23.32 45.6,23.62 45.6,24.23 46.15,24.77 50.85,24.77 52.88,22.75 52.88,21.64 SJ1.1 | C18.2 45.12,19.38 | C18.2 45.88,18.62 46.25,18.62 46.5,18.38 46.5,15.62 46.5,14.75 46.25,14.5 45.88,14.5 45.5,14.12 45.5,8.62 46,8.12 46.35,8.12 R17.2 46.85,8.62 48.75,8.62 49.5,9.38 49.5,10.12 50.27,10.89 U$5.9 | v45.5,21.12 45.5,20.62 45,20.12 45,19.75 C18.2
  Bottom 0.254: v43.75,21.38 45.25,21.38 v45.5,21.12
XOUT-1X-2
  Top 0.254: SJ3.1 57.51,21.51 57.5,21.5 57.5,20.12 57.88,19.75 57.88,18.5 58.52,17.85 R25.2 59.48,17 60.62,17 61.5,17.88 63.12,17.88 C24.2 63.5,16.12 64.5,15.12 64.94,15.12 U$6.5
XOUT-4X  (via drill 0.6)
  Top 0.254: 54,20.12 54.64,20.76 SJ1.3 SJ1.2 53.75,20.62 53.62,20.5 52.38,20.5 52,20.88 52,21.51 SJ4.1 51.39,21.74 | 54,20.12 | 54,20.12 53.88,20 52.38,20 52.25,19.88 52.25,17.75 v52.5,18 | v48.75,11.75 49.68,11.75 U$5.8
  Bottom 0.254: v52.5,18 51.62,17.12 48.12,17.12 47.75,16.75 47.75,13.88 48.75,12.88 v48.75,11.75
XOUT-4X-2  (via drill 0.6)
  Top 0.254: v54.5,24.12 55.74,22.89 SJ3.3 SJ3.2 56.5,21.75 v56.5,23.62 | v61.12,23.12 61.5,23.12 62,22.62 63.5,22.62 64.5,21.62 v64.25,21.62 | U$6.6 63.84,13.91 v63.38,14.38 | v40.88,21.38 40.88,21.75 41.62,22.5 41.62,23.62 42.02,24.02 44.33,24.02 v44.55,24.25 | IC1.23 33.56,22.94 v33.38,23.12 | v46.5,23.62 46.5,23.75 47,24.25 49.88,24.25 50.5,23.62 SJ4.2 | SJ4.2 | v48.5,23.38 48.75,23.12 49.5,23.12 49.61,23.01 SJ4.3 SJ4.2
  Bottom 0.254: v54.5,24.12 54.5,24.62 55,25.12 56.3,25.12 57.8,23.62 60.5,23.62 61,23.12 v61.12,23.12 | 64,20.38 64,17.38 63,16.38 63,14.75 v63.38,14.38 | 64,20.38 | 64,20.38 64,21.38 v64.25,21.62 | v40.88,21.38 40.38,21.88 35.62,21.88 34.38,23.12 v33.38,23.12 | v44.55,24.25 45.88,24.25 v46.5,23.62 | v48.5,23.38 48.75,23.12 56,23.12 v56.5,23.62
YOUT-1X  (via drill 0.6)
  Top 0.254: SJ2.1 30.36,24.86 v30.5,25 | C20.2 49.62,17.38 | 49.62,17.38 | U$5.5 50.92,15.2 49.62,16.5 49.62,17.38 | C20.2 | C20.2 48.88,17.38 | v48,19.5 48,18.88 48.75,18.12 48.88,18.12 C20.2 | R19.2 49.12,17.62 C20.2
  Bottom 0.254: v30.5,25 31.5,24 34.25,24 35.75,22.5 40.62,22.5 40.88,22.25 45.62,22.25 46.38,21.5 46.38,21.25 47.25,20.38 47.75,20.38 48,20.12 v48,19.5 | v48,19.5
YOUT-4X  (via drill 0.6)
  Top 0.203: v42.62,19.5 42.62,18.75 44.25,17.12 44.25,16.75
  Top 0.254: 42.5,22.62 42.25,22.38 v42.25,21.38 | v44.12,10.38 44.5,10.75 44.5,12 | v32,25 32.14,24.86 SJ2.3 SJ2.2 | U$5.6 49.21,13.91 49.21,14.96 v49.25,15 | v42.5,23.12 42.5,22.62 | 42.5,22.62 | 44.25,16.75 44.25,13.88 44.5,13.62 44.5,12 | 44.5,12 | 32.75,21.49 IC1.24 32.4,21.48 31.25,22.62 SJ2.2 | SJ2.2 31.38,23.25
  Bottom 0.254: v42.5,23.12 35.88,23.12 34.5,24.5 32.5,24.5 v32,25 | v42.62,19.5 42.62,20 42.25,20.38 v42.25,21.38 | v42.25,21.38 | v49.25,15 49.62,15 50.38,14.25 50.38,10.75 51,10.12 51,9.12 51.5,8.62 51.5,7.62 51.25,7.38 47.75,7.38 44.75,10.38 v44.12,10.38
ZOUT-1X  (via drill 0.6)
  Top 0.254: 65,10.71 U$6.9 64.27,10.89 63.75,10.38 | SJ5.1 26.25,24.38 v25.5,25.12 | 63.75,10.38 | 63.75,10.38 63.38,10 62,10 v61.75,9.75 | v34.87,27.5 34.87,30.62 35.66,31.43 42.7,31.43 v44,30.12 | v55.65,26.62 55.95,26.32 58.65,26.32 59.55,25.43 59.55,22.62 | 62,19.62 62,19.5 C26.2 62,19.25 62,19.62 | 59.55,22.62 59.55,22.57 | 59.55,22.62 59.42,22.5 v59.12,22.5 59.25,22.38 59.75,22.38 60.75,21.38 60.75,20.88 62,19.62 | R27.2 63.5,10.12 63.75,10.38
  Bottom 0.254: v25.5,25.12 25.5,26.12 26.5,27.12 27.88,27.12 28.62,26.38 33.75,26.38 v34.88,27.5 v34.87,27.5 | v61.75,9.75 60.25,11.25 60.25,17.88 | 60.25,17.88 | v44,30.12 45,29.12 53.2,29.12 53.2,29.07 v55.65,26.62 | 60.25,17.88 60.25,19.12 59.25,20.12 59,20.12 58.62,20.5 58.62,22 v59.12,22.5
ZOUT-4X  (via drill 0.6)
  Top 0.254: v27.5,26.12 28.64,24.99 SJ5.3 SJ5.2 27.88,24.25 27.88,23.25 v28.5,22.62 | v62.25,11 62.38,11.12 63.5,11.12 64,11.62 | v34.5,25.5 34.5,25.62 35,26.12 38.25,26.12 v38.5,26.38 | 64,11.62 | U$6.8 64.43,12.25 64.43,12.05 64,11.62 | IC1.25 31.27,20.86 v30.5,21.62
  Bottom 0.254: v62.25,11 62.12,11.12 61.5,11.12 61,11.62 61,17.38 62,18.38 62,20.12 | 62.75,21.38 62.75,22.38 62,23.12 62,23.62 61.5,24.12 58.05,24.12 56.45,25.73 49,25.73 48.5,26.23 46.6,28.12 42.5,28.12 42,27.62 40.5,26.12 38.75,26.12 v38.5,26.38 | v27.5,26.12 | v27.5,26.12 27.75,25.88 | 27.75,25.88 | v34.5,25.5 34.12,25.88 27.75,25.88 | 62,20.12 62.75,20.88 62.75,21.38 | 62.75,21.38 | 62,20.12 | v27.5,26.12 27.75,25.88 | v30.5,21.62 29.5,21.62 v28.5,22.62
(copper drawn outside any net)
  shapes: Top circle x3

### Text on the board
Top: diptera | v0.2 | 3.5- | 16V | AUX | RXTX | STAT | CONN | GYR: | 1500 | 300 | ISP | COM | RST
Bottom: PWR | bit@fnor.de | 2010